# Altium schematic sheet MAGI'sUSBCore.SchDoc
size A4
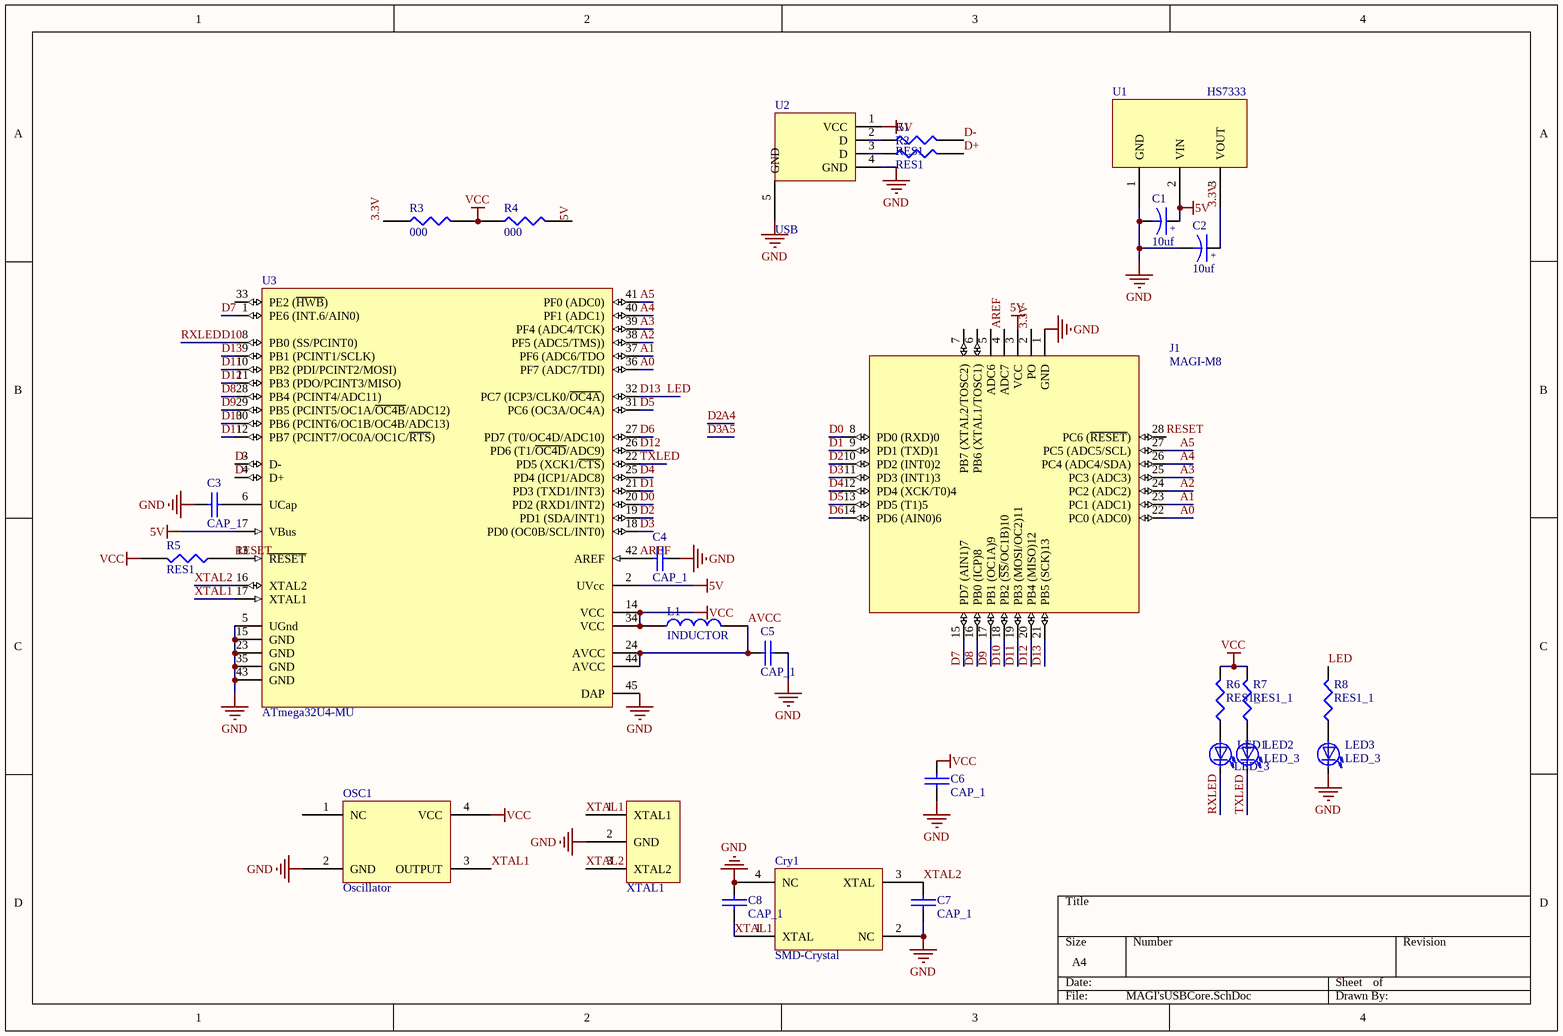
[diagram p0: MAGI'sUSBCore.SchDoc]

## Parts
C1  10uf  [6-0805_N]
C2  10uf  [6-0805_N]
C3  CAP_1  [6-0805_N]
C4  CAP_1  [6-0805_N]
C5  CAP_1  [6-0805_N]
C6  CAP_1  [C1210_N]
C7  CAP_1  [1608[0603]]
C8  CAP_1  [1608[0603]]
Cry1  SMD-Crystal  [3225]
J1  MAGI-M8  [MAGI-M8]
L1  INDUCTOR  [C1210_N]
LED1  LED_3  [6-0805_N]
LED2  LED_3  [6-0805_N]
LED3  LED_3  [6-0805_N]
OSC1  Oscillator  [Oscillator]
R1  RES1  [6-0805_N]
R2  RES1  [6-0805_N]
R3  000  [6-0805_N]
R4  000  [6-0805_N]
R5  RES1  [6-0805_N]
R6  RES1_1  [6-0805_N]
R7  RES1_1  [6-0805_N]
R8  RES1_1  [6-0805_N]
U1  HS7333  [HS7333]
U2  USB  [MicroUSB]
U3  ATmega32U4-MU  [44PW_N]
XTAL1  CSTCE16M00G53  [CSTCE_V]  (value not drawn)

## Nets
5V: C1.1 J1.3(VCC) R4.2 U1.2(VIN) U2.1(VCC) U3.2(UVcc) U3.7(VBus)
GND: C1.2 C2.2 C3.2 C4.1 C5.1 C6.1 C7.1 C8.2 Cry1.2(NC) Cry1.4(NC) J1.1(GND) LED3.2(K) OSC1.2(GND) U1.1(GND) U2.4(GND) U2.5(GND) U3.5(UGnd) U3.15(GND) U3.23(GND) U3.35(GND) U3.43(GND) U3.45(DAP) XTAL1.2(GND)
VCC: C6.2 L1.2 OSC1.4(VCC) R3.2 R4.1 R5.2 R6.2 R7.2 U3.14(VCC) U3.34(VCC)
3.3V: C2.1 J1.2(PO) R3.1 U1.3(VOUT)
A0: J1.22(PC0_(ADC0)) U3.36(PF7_(ADC7/TDI))
A1: J1.23(PC1_(ADC1)) U3.37(PF6_(ADC6/TDO)
A2: J1.24(PC2_(ADC2)) U3.38(PF5_(ADC5/TMS)))
A3: J1.25(PC3_(ADC3)) U3.39(PF4_(ADC4/TCK))
A4: J1.10(PD2_(INT0)2) J1.26(PC4_(ADC4/SDA)) U3.19(PD1_(SDA/INT1)) U3.40(PF1_(ADC1))  [also labelled D2]
A5: J1.11(PD3_(INT1)3) J1.27(PC5_(ADC5/SCL)) U3.18(PD0_(OC0B/SCL/INT0)) U3.41(PF0_(ADC0))  [also labelled D3]
AREF: C4.2 J1.4(ADC7) U3.42(AREF)
AVCC: C5.2 L1.1 U3.24(AVCC) U3.44(AVCC)
D0: J1.8(PD0_(RXD)0) U3.20(PD2_(RXD1/INT2))
D1: J1.9(PD1_(TXD)1) U3.21(PD3_(TXD1/INT3))
D4: J1.12(PD4_(XCK/T0)4) U3.25(PD4_(ICP1/ADC8))
D5: J1.13(PD5_(T1)5) U3.31(PC6_(OC3A/OC4A))
D6: J1.14(PD6_(AIN0)6) U3.27(PD7_(T0/OC4D/ADC10))
D7: J1.15(PD7_(AIN1)7) U3.1(PE6_(INT.6/AIN0))
D8: J1.16(PB0_(ICP)8) U3.28(PB4_(PCINT4/ADC11))
D9: J1.17(PB1_(OC1A)9) U3.29(PB5_(PCINT5/OC1A/~{OC4B}/ADC12))
D10: J1.18(PB2_(~{SS}/OC1B)10) LED1.2(K) U3.8(PB0_(SS/PCINT0)) U3.30(PB6_(PCINT6/OC1B/OC4B/ADC13))  [also labelled RXLED]
D11: J1.19(PB3_(MOSI/OC2)11) U3.10(PB2_(PDI/PCINT2/MOSI)) U3.12(PB7_(PCINT7/OC0A/OC1C/~{RTS}))
D12: J1.20(PB4_(MISO)12) U3.11(PB3_(PDO/PCINT3/MISO)) U3.26(PD6_(T1/~{OC4D}/ADC9))
D13: J1.21(PB5_(SCK)13) R8.2 U3.9(PB1_(PCINT1/SCLK)) U3.32(PC7_(ICP3/CLK0/~{OC4A}))  [also labelled LED]
D+: R2.2 U3.4(D+)
D-: R1.2 U3.3(D-)
RESET: J1.28(PC6_(~{RESET})) R5.1 U3.13(~{RESET})
TXLED: LED2.2(K) U3.22(PD5_(XCK1/~{CTS}))
XTAL1: C8.1 Cry1.1(XTAL) OSC1.3(OUTPUT) U3.17(XTAL1) XTAL1.1(XTAL1)
XTAL2: C7.2 Cry1.3(XTAL) U3.16(XTAL2) XTAL1.3(XTAL2)
NetC3_1: C3.1 U3.6(UCap)
NetLED1_1: LED1.1(A) R6.1
NetLED2_1: LED2.1(A) R7.1
NetLED3_1: LED3.1(A) R8.1
NetR1_1: R1.1 U2.2(D)
NetR2_1: R2.1 U2.3(D)

Not connected (* = marked no-connect by the designer): J1 5(ADC6) 6(PB6_(XTAL1/TOSC1)) 7(PB7_(XTAL2/TOSC2)); OSC1 1(NC); U3 33(PE2_(~{HWB}))

## Notes on the sheet
- (in symbol CAPACITOR POL) +

## Library data of the parts
C1 C2 = CAPACITOR POL: Capacitor
C3-C8 = CAP_1: Capacitor
Cry1 = Crystal
R3 R4 = RES1
U3 = ATmega32U4-MU: 8-bit AVR Microcontroller, 2.7-5.5V, 32KB Flash, 2.5KB EEPROM, 1KB SRAM, USB Controller, 44-pin QFN, Industrial Grade (-40癈 to 85癈); Published: 1-Apr-2010; DatasheetVersion: revD, Jan-2009; PackageVersion: revF, Jul-2007; PackageReference: 44PW; Publisher: Altium Limited; PackageDescription: 44-Pin Quad Flat No-Lead Package, 7 x 7 mm Body, 0.5 mm Pitch (QFN); Supplier 1: Digi-Key; Supplier Part Number 1: ATMEGA32U4-MU-ND; Supplier 2: Mouser; Supplier Part Number 2: 556-ATMEGA32U4-MU; Code_JEDEC: MO-220-VKKD-1; ComponentLink1Description: Manufacturer Link; ComponentLink1URL: http://www.atmel.com/products/avr/default.asp?; ComponentLink2Description: ATmega16U4/32U4 Datasheet; ComponentLink2URL: http://www.atmel.com/dyn/resources/prod_documents/doc7766.pdf; ComponentLink3Description: ATmega16U4 ATmega32U4 Summary; ComponentLink3URL: http://www.atmel.com/dyn/resources/prod_documents/7766S.pdf; ComponentLink4Description: Atmel.com Home; ComponentLink4URL: http://www.atmel.com